# EAGLE design placa_final (EAGLE 8.0.1)
COMPANY: Unexpected Maker; DATE: 24-10-2018; DRAWN: Seon; REV: V1; TITLE: TinyPICO

## Sheet 1 of 2
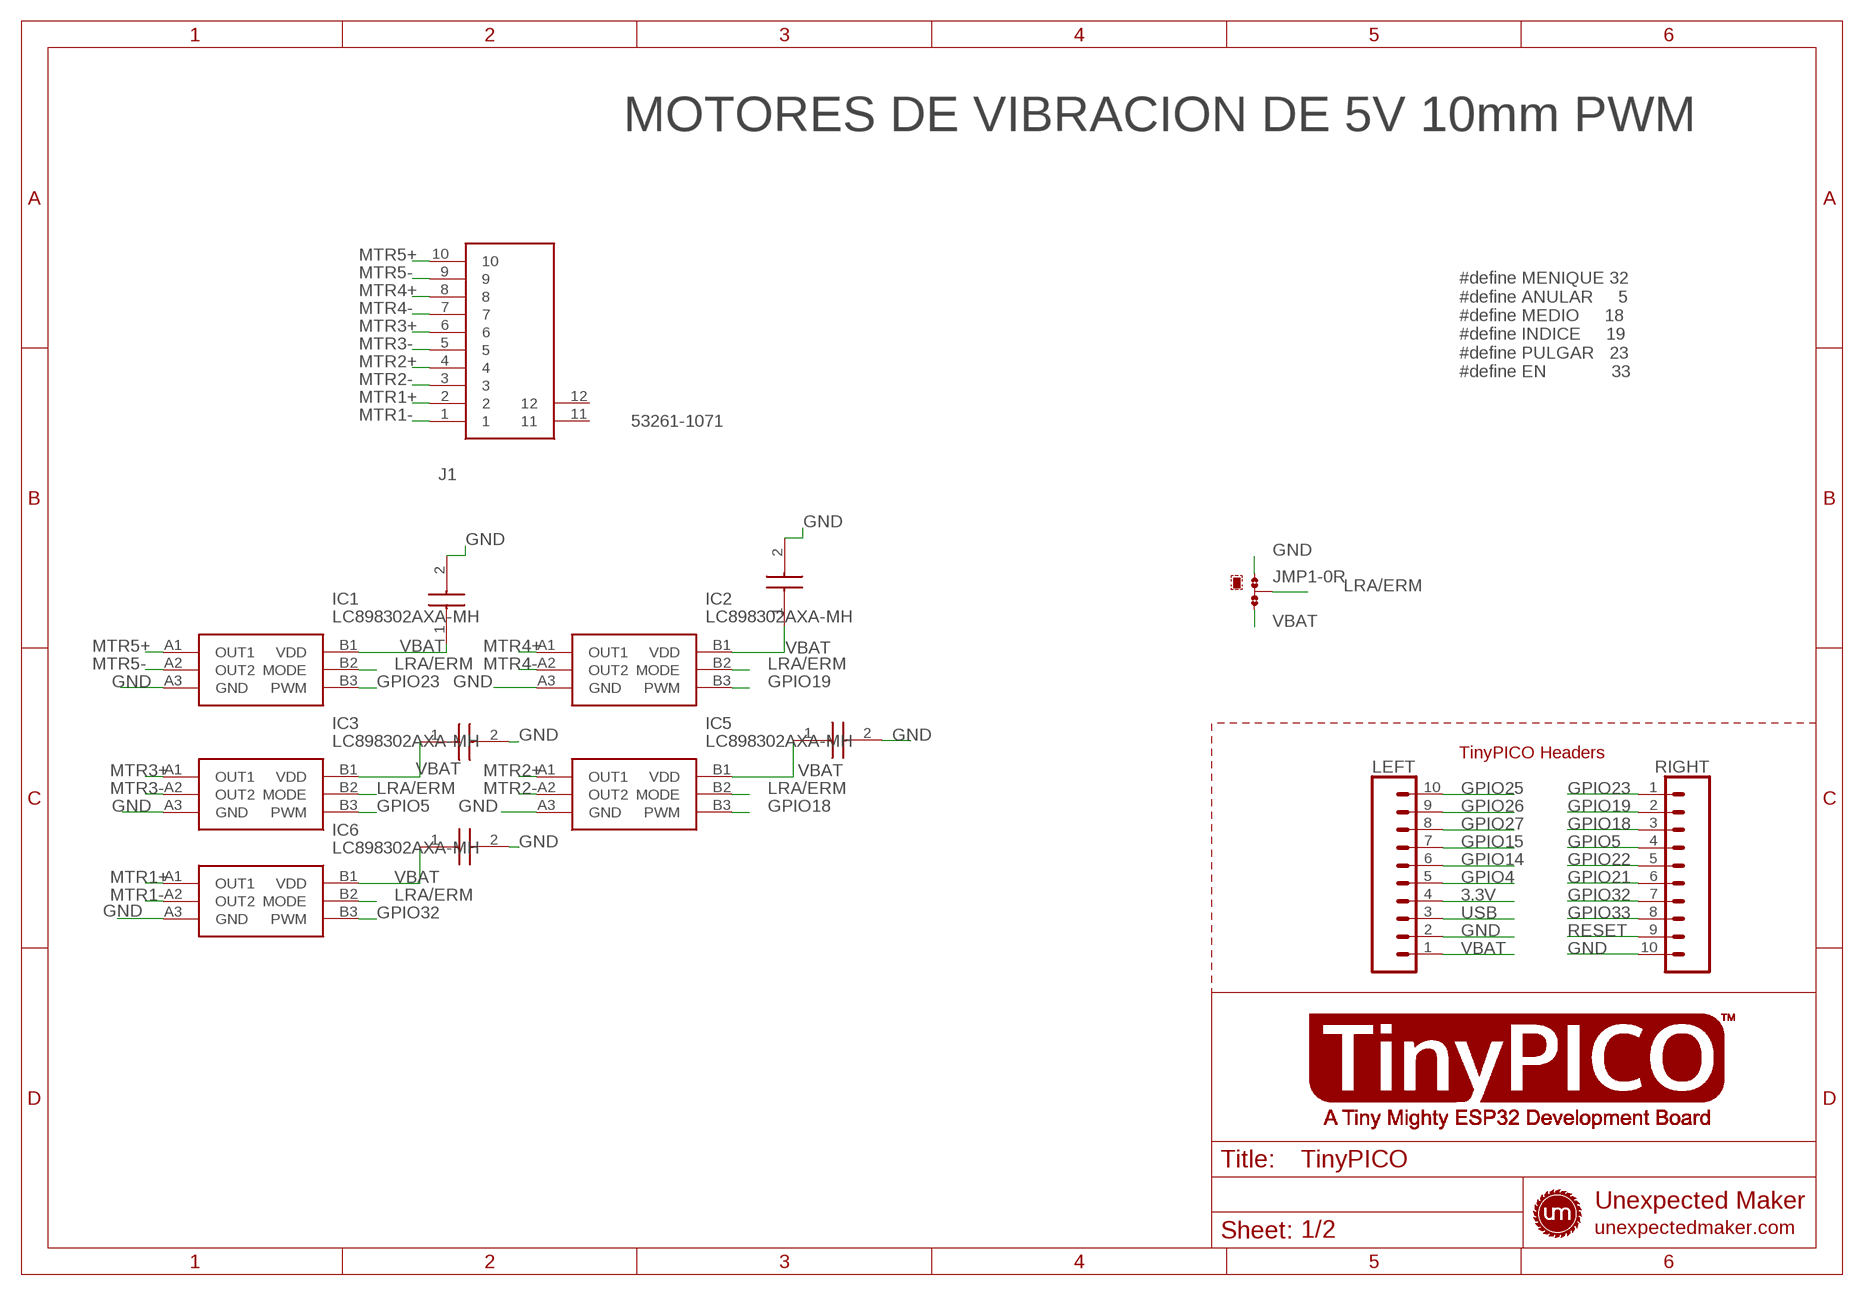
[diagram p0: schematic, sheet 1]

### Parts
C1  0603B104K160CT  [CAPC1608X87N]
C2  0603B104K160CT  [CAPC1608X87N]
C3  0603B104K160CT  [CAPC1608X87N]
C4  0603B104K160CT  [CAPC1608X87N]
C5  0603B104K160CT  [CAPC1608X87N]
IC1  LC898302AXA-MH  [BGA6C40P3X2_118X78X65]
IC2  LC898302AXA-MH  [BGA6C40P3X2_118X78X65]
IC3  LC898302AXA-MH  [BGA6C40P3X2_118X78X65]
IC5  LC898302AXA-MH  [BGA6C40P3X2_118X78X65]
IC6  LC898302AXA-MH  [BGA6C40P3X2_118X78X65]
J1  53261-1071  [532611071]
JMP1  0R-JUMPA  [A0R-JMP]
LEFT  TINYPICO_HEADER_10NO_SILK_PTH_FEMALE  [1X10_NO_SILK]
RIGHT  TINYPICO_HEADER_10NO_SILK_PTH_FEMALE  [1X10_NO_SILK]

### Nets
3.3V: LEFT.4 ; also sheet 2
GND: C1.2 C2.2 C3.2 C4.2 C5.2 IC1.A3(GND) IC2.A3(GND) IC3.A3(GND) IC5.A3(GND) IC6.A3(GND) JMP1.1 LEFT.2 RIGHT.10 ; also sheet 2
GPIO4: LEFT.5 ; also sheet 2
GPIO5: IC3.B3(PWM) RIGHT.4
GPIO14: LEFT.6 ; also sheet 2
GPIO15: LEFT.7 ; also sheet 2
GPIO18: IC5.B3(PWM) RIGHT.3
GPIO19: IC2.B3(PWM) RIGHT.2
GPIO21: RIGHT.6
GPIO22: RIGHT.5
GPIO23: IC1.B3(PWM) RIGHT.1
GPIO25: LEFT.10
GPIO26: LEFT.9
GPIO27: LEFT.8 ; also sheet 2
GPIO32: IC6.B3(PWM) RIGHT.7
GPIO33: RIGHT.8
LRA/ERM: IC1.B2(MODE) IC2.B2(MODE) IC3.B2(MODE) IC5.B2(MODE) IC6.B2(MODE) JMP1.2
MTR1+: IC6.A1(OUT1) J1.2
MTR1-: IC6.A2(OUT2) J1.1
MTR2+: IC5.A1(OUT1) J1.4
MTR2-: IC5.A2(OUT2) J1.3
MTR3+: IC3.A1(OUT1) J1.6
MTR3-: IC3.A2(OUT2) J1.5
MTR4+: IC2.A1(OUT1) J1.8
MTR4-: IC2.A2(OUT2) J1.7
MTR5+: IC1.A1(OUT1) J1.10
MTR5-: IC1.A2(OUT2) J1.9
RESET: RIGHT.9 ; also sheet 2
USB: LEFT.3
VBAT: C1.1 C2.1 C3.1 C4.1 C5.1 IC1.B1(VDD) IC2.B1(VDD) IC3.B1(VDD) IC5.B1(VDD) IC6.B1(VDD) JMP1.3 LEFT.1
Unconnected: J1.11 J1.12

### Notes on the sheet
- MOTORES DE VIBRACION DE 5V 10mm PWM
- #define MENIQUE 32
  #define ANULAR     5
  #define MEDIO     18
  #define INDICE     19
  #define PULGAR   23
  #define EN             33
- TinyPICO Headers

## Sheet 2 of 2: Botons
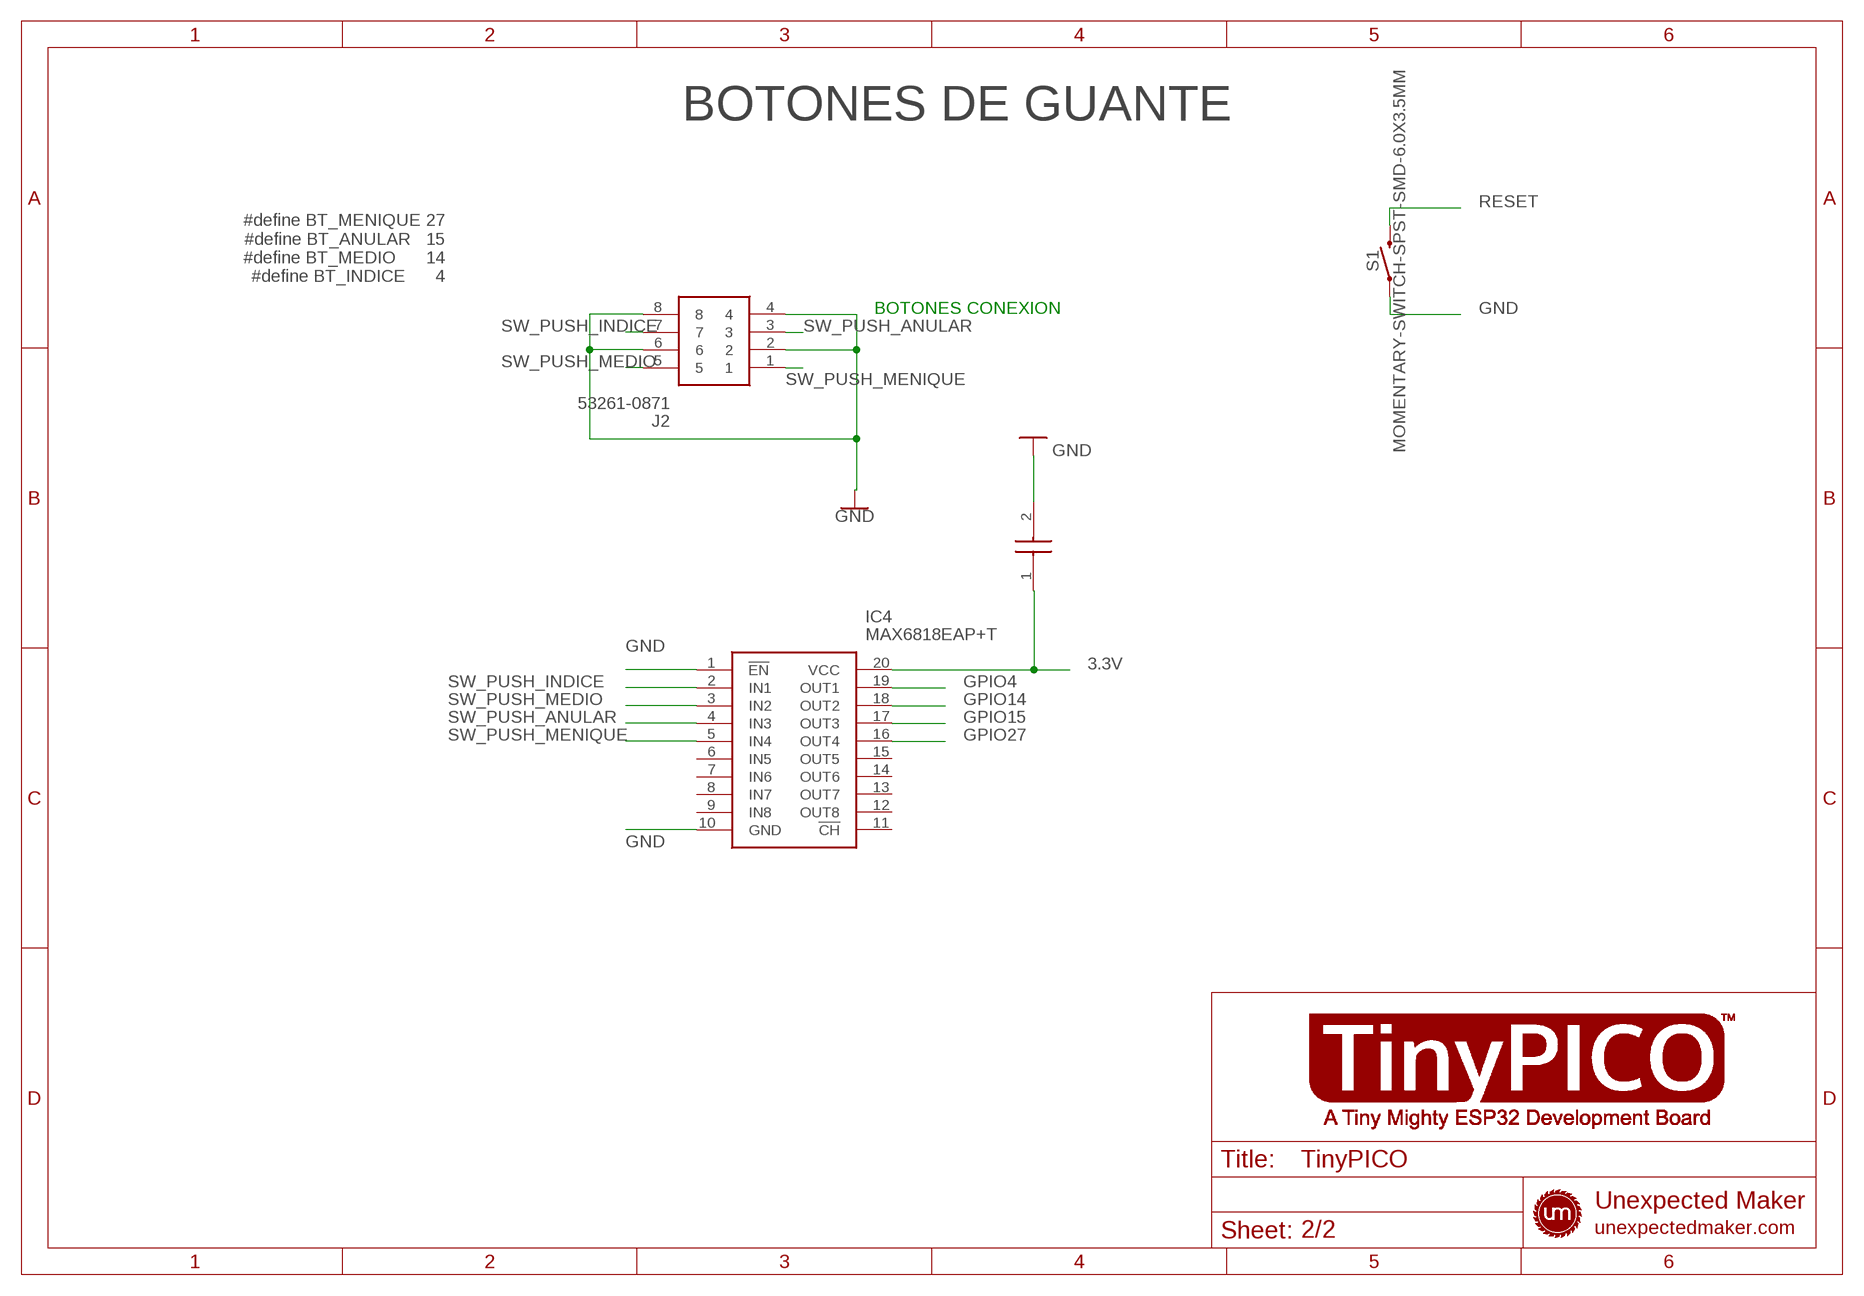
[diagram p1: schematic, sheet 2]

### Parts
C8  0603B104K160CT  [CAPC1608X87N]
IC4  MAX6818EAP+T  [SOP65P778X199-20N]
J2  53261-0871  [53261-0871]
S1  MOMENTARY-SWITCH-SPST-SMD-6.0X3.5MM  [TACTILE_SWITCH_SMD_6.0X3.5MM]

### Nets
3.3V: C8.1 IC4.20(VCC) ; also sheet 1
GND: C8.2 IC4.1(!EN) IC4.10(GND) J2.2 J2.4 J2.6 J2.8 S1.1 ; also sheet 1
GPIO4: IC4.19(OUT1) ; also sheet 1
GPIO14: IC4.18(OUT2) ; also sheet 1
GPIO15: IC4.17(OUT3) ; also sheet 1
GPIO27: IC4.16(OUT4) ; also sheet 1
RESET: S1.2 ; also sheet 1
SW_PUSH_ANULAR: IC4.4(IN3) J2.3
SW_PUSH_INDICE: IC4.2(IN1) J2.7
SW_PUSH_MEDIO: IC4.3(IN2) J2.5
SW_PUSH_MENIQUE: IC4.5(IN4) J2.1
Unconnected: IC4.6(IN5) IC4.7(IN6) IC4.8(IN7) IC4.9(IN8) IC4.11(!CH) IC4.12(OUT8) IC4.13(OUT7) IC4.14(OUT6) IC4.15(OUT5)

### Notes on the sheet
- BOTONES DE GUANTE
- #define BT_MENIQUE 27
  #define BT_ANULAR   15
  #define BT_MEDIO      14
  #define BT_INDICE      4
- BOTONES CONEXION

## Library data of the parts
C1-C5 C8 = SamacSys_Parts:0603B104K160CT: WALSIN - 0603B104K160CT - CAP, 0.1F, 16V, 10%, X7R, 0603 Source: Datasheet <https://componentsearchengine.com/Datasheets/1/0603B104K160CT.pdf>; DESCRIPTION: WALSIN - 0603B104K160CT - CAP, 0.1F, 16V, 10%, X7R, 0603; HEIGHT: 0.87mm; MANUFACTURER_NAME: Walsin Technology Corporation; MANUFACTURER_PART_NUMBER: 0603B104K160CT; MOUSER_PART_NUMBER: 791-0603B104K160CT; MOUSER_PRICE-STOCK: https://www.mouser.com/Search/Refine.aspx?Keyword=791-0603B104K160CT
IC1-IC3 IC5 IC6 = SamacSys_Parts:LC898302AXA-MH: Motor / Motion / Ignition Controllers & Drivers Linear Vibrator Driv Source: Datasheet <https://www.arrow.com/en/products/lc898302axa-mh/on-semiconductor>; DESCRIPTION: Motor / Motion / Ignition Controllers & Drivers Linear Vibrator Driv; HEIGHT: 0.65mm; MANUFACTURER_NAME: ON Semiconductor; MANUFACTURER_PART_NUMBER: LC898302AXA-MH; MOUSER_PART_NUMBER: 863-LC898302AXA-MH; MOUSER_PRICE-STOCK: https://www.mouser.co.uk/ProductDetail/ON-Semiconductor/LC898302AXA-MH?qs=raqtESnDWsCbGq19hBfPlw%3D%3D
IC4 = SamacSys_Parts:MAX6818EAP+T: MAXIM INTEGRATED PRODUCTS - MAX6818EAP+T. - ESD PROTE WITH SWITCH DEBOUNCER, SSOP-20 Source: Datasheet; DESCRIPTION: MAXIM INTEGRATED PRODUCTS - MAX6818EAP+T. - ESD PROTE WITH SWITCH DEBOUNCER, SSOP-20; HEIGHT: 1.99mm; MANUFACTURER_NAME: Maxim Integrated; MANUFACTURER_PART_NUMBER: MAX6818EAP+T; MOUSER_PART_NUMBER: 700-MAX6818EAPT; MOUSER_PRICE-STOCK: https://www.mouser.co.uk/ProductDetail/Maxim-Integrated/MAX6818EAP%2bT?qs=CDqwynd4ZNoKt6d34O8j%252BA%3D%3D
J1 = SamacSys_Parts:53261-1071: 10 way SMT r/a header Molex PICOBLADE Series, Series Number 53261, 1.25mm Pitch 10 Way 1 Row Shrouded Right Angle PCB Header, Surface Mount Source: Datasheet <https://www.molex.com/webdocs/datasheets/pdf/en-us/0532611071_PCB_HEADERS.pdf>; DESCRIPTION: 10 way SMT r/a header Molex PICOBLADE Series, Series Number 53261, 1.25mm Pitch 10 Way 1 Row Shrouded Right Angle PCB Header, Surface Mount; HEIGHT: 3mm; MANUFACTURER_NAME: Molex; MANUFACTURER_PART_NUMBER: 53261-1071; MOUSER_PART_NUMBER: 538-53261-1071; MOUSER_PRICE-STOCK: https://www.mouser.co.uk/ProductDetail/Molex/53261-1071?qs=%252B72YyncTwW%252Bzs3RwZTiukQ%3D%3D
J2 = SamacSys_Parts:53261-0871: Molex PICOBLADE Series, Series Number 53261, 1.25mm Pitch, 8 Way 1 Row Shrouded Right Angle PCB Header, Surface Mount Source: Datasheet <http://www.molex.com/webdocs/datasheets/pdf/en-us/0532610871_PCB_HEADERS.pdf>; DESCRIPTION: Molex PICOBLADE Series, Series Number 53261, 1.25mm Pitch, 8 Way 1 Row Shrouded Right Angle PCB Header, Surface Mount; HEIGHT: mm; MANUFACTURER_NAME: Molex; MANUFACTURER_PART_NUMBER: 53261-0871; MOUSER_PART_NUMBER: 538-53261-0871; MOUSER_PRICE-STOCK: https://www.mouser.co.uk/ProductDetail/Molex/53261-0871?qs=%252B72YyncTwW%252BggfdCJ7Netw%3D%3D
JMP1 = jump-0r-smd:0R-JUMP: SMD 0R 0805 Jumper
LEFT RIGHT = UnexpectedMaker:TINYPICO_HEADER_10: Multi connection point. Often used as Generic Header-pin footprint for 0.1 inch spaced/style header connections On any of the 0.1 inch spaced packages, you can populate with these: Break Away Headers - Straight <https://www.sparkfun.com/products/116> (PRT-00116) Break Away Male Headers - Right Angle <https://www.sparkfun.com/products/553> (PRT-00553) Female Headers <https://www.sparkfun.com/products/115> (PRT-00115) Break Away Headers - Machine Pin <https://www.sparkfun.com/products/117> (PRT-00117) Break Away Female Headers - Swiss Machine Pin <https://www.sparkfun.com/products/743> (PRT-00743) Arduino Stackable Header - 10 Pin <https://www.sparkfun.com/products/11376> (PRT-11376) For SCREWTERMINALS and SPRING TERMINALS visit here: Screw Terimnals on SparkFun.com <https://www.sparkfun.com/search/results?term=Screw+Terminals> (5mm/3.5mm/2.54mm spacing) This device is also useful as a general connection point to wire up your design to another part of your project. Our various solder wires solder well into these plated through hole pads. Hook-Up Wire - Assortment (Stranded, 22 AWG) <https://www.sparkfun.com/products/11375> (PRT-11375) Hook-Up Wire - Assortment (Solid Core, 22 AWG) <https://www.sparkfun.com/products/11367> (PRT-11367) View the entire wire category on our website here <https://www.sparkfun.com/categories/141> Special notes: Molex polarized connector foot print use with SKU : PRT-08231 with associated crimp pins and housings. 1MM SMD Version SKU: PRT-10208 NOTES ON THE VARIANTS LOCK and LOCK_LONGPADS... This footprint was designed to help hold the alignment of a through-hole component (i.e. 6-pin header) while soldering it into place. You may notice that each hole has been shifted either up or down by 0.005 of an inch from it's more standard position (which is a perfectly straight line). This slight alteration caused the pins (the squares in the middle) to touch the edges of the holes. Because they are alternating, it causes a "brace" to hold the component in place. 0.005 has proven to be the perfect amount of "off-center" position when using our standard breakaway headers. Although looks a little odd when you look at the bare footprint, once you have a header in there, the alteration is very hard to notice. Also,if you push a header all the way into place, it is covered up entirely on the bottom side.; PROD_ID: CONN-11563
S1 = SparkFun-Switches:MOMENTARY-SWITCH-SPST: Momentary Switch (Pushbutton) - SPST Normally-open (NO) SPST momentary switches (buttons, pushbuttons). Variants PTH-12MM - 12mm square, through-hole Momentary Pushbutton Switch - 12mm Square <https://www.sparkfun.com/products/9190> (COM-09190) PTH-6.0MM, PTH-6.0MM-KIT - 6.0mm square, through-hole Mini Pushbutton Switch <https://www.sparkfun.com/products/97> (COM-00097) KIT package intended for soldering kit's - only one side of pads' copper is exposed. PTH-RIGHT-ANGLE-KIT - Right-angle, through-hole Right Angle Tactile Button <https://www.sparkfun.com/products/10791> - Used on SparkFun BigTime Watch Kit <https://www.sparkfun.com/products/11734> SMD-12MM - 12mm square, surface-mount Tactile Button - SMD (12mm) <https://www.sparkfun.com/products/12993> (COM-12993) Used on SparkFun PicoBoard <https://www.sparkfun.com/products/11888> SMD-4.5MM - 4.5mm Square Trackball Switch Used on SparkFun Blackberry Trackballer Breakout <https://www.sparkfun.com/products/13169> SMD-4.6MMX2.8MM - 4.60mm x 2.80mm, surface mount Used on SparkFun SAMD21 Mini Breakout <https://www.sparkfun.com/products/13664> SMD-5.2MM, SMD-5.2-REDUNDANT - 5.2mm square, surface-mount Mini Pushbutton Switch - SMD <https://www.sparkfun.com/products/8720> (COM-08720) Used on Arduino Pro Mini <https://www.sparkfun.com/products/11114> REDUNDANT package connects both switch circuits together SMD-6.0X3.5MM - 6.0 x 3.5mm, surface mount Momentary Reset Switch SMD <https://www.sparkfun.com/products/8229> (COM-08229) SMD-6.2MM-TALL - 6.2mm square, surface mount Tactile Button - SMD (6mm) <https://www.sparkfun.com/products/12992> Used on SparkFun Digital Sandbox <https://www.sparkfun.com/products/12651> SMD-RIGHT-ANGLE - Right-angle, surface mount Used on SparkFun Block for Intel® Edison - Arduino <https://www.sparkfun.com/products/13036>; PROD_ID: SWCH-00815; SF_SKU: COM-08229

## Board
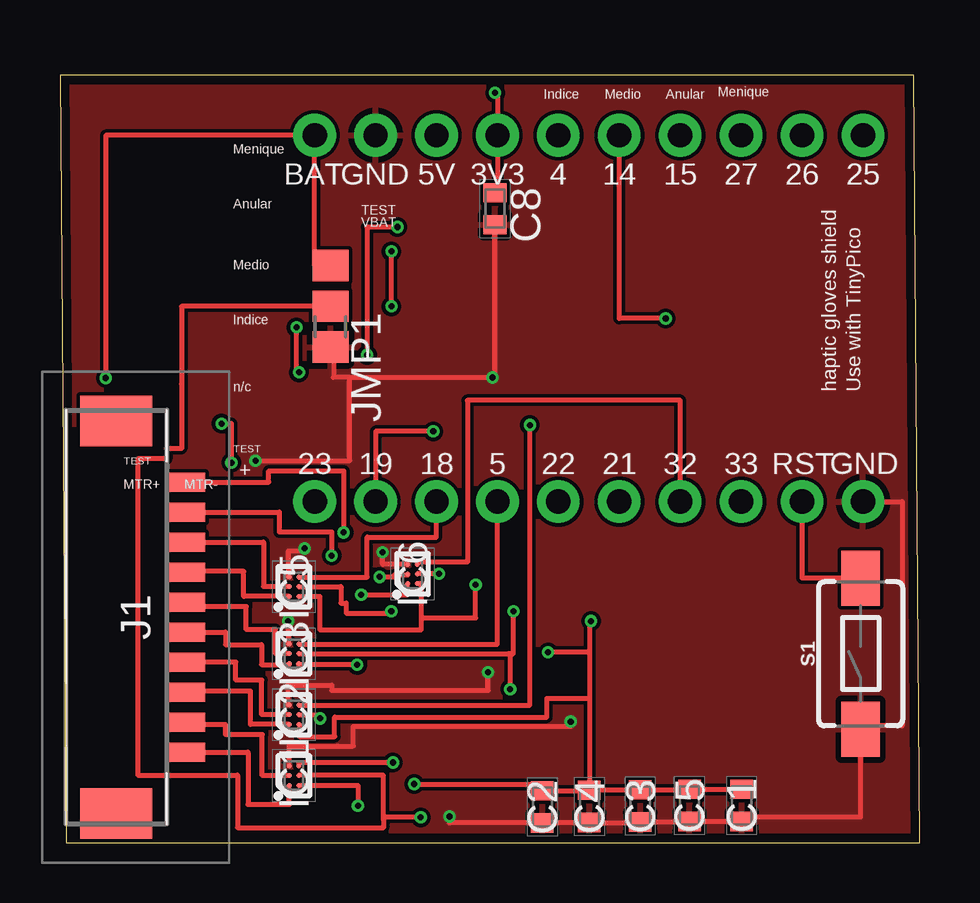
[diagram p2: board, top side]
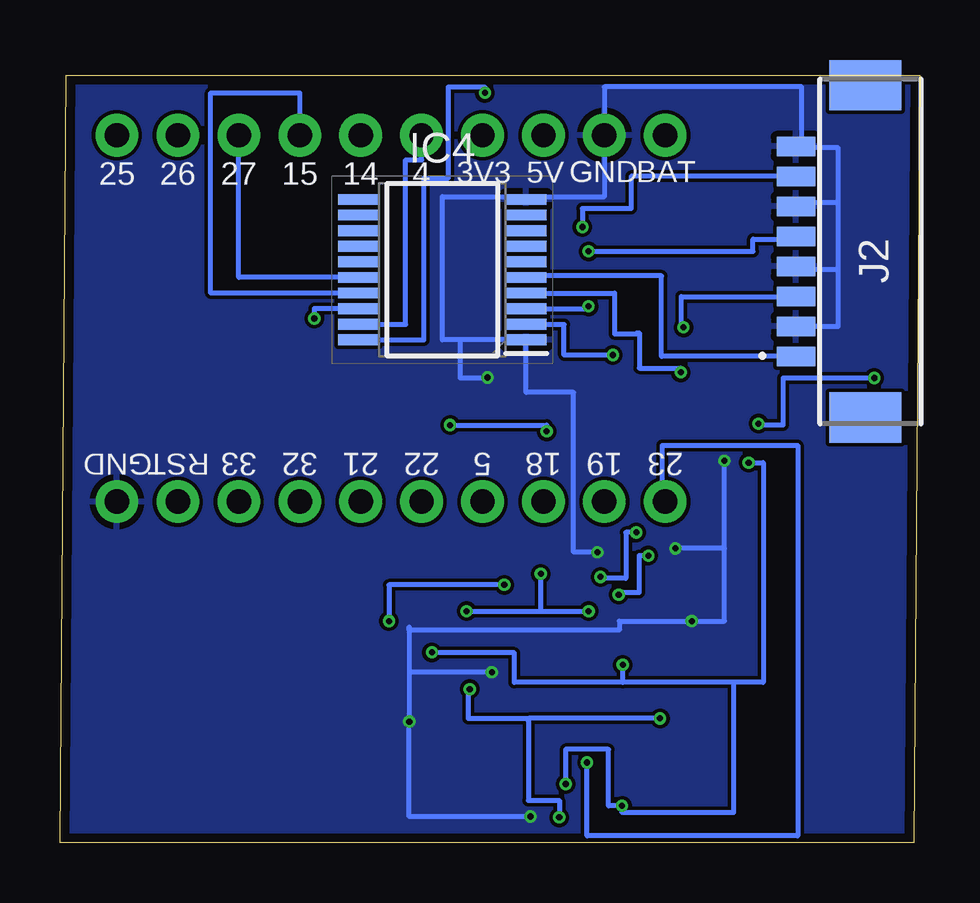
[diagram p3: board, bottom side, seen from below]

Size 35.85 x 31.97 mm. Coordinates in mm from the lower left corner, seen from the top.
Outline: 0,31.97 0.25,0 35.85,0 35.6,31.97 0,31.97
Copper layers (1*16): Top 0.035559375mm / dielectric 1.6mm / Bottom 0.035559375mm
Design rules "oshpark-2layer": minimum track width 6mil, minimum drill 10mil, track to track 6mil, track to pad 6mil, pad to pad 6mil, via to via 6mil, smd to smd 6mil, copper to edge 15mil, drill to drill 6mil, minimum pad ring 5mil, minimum via ring 5mil, stop-mask expansion 2.5mil, vias tented up to drill 0mil, thermal gap 10mil

### Footprints (pad centres in the part's own frame; a part is rotated, then mirrored left to right if it is on the bottom)
CAPC1608X87N = smd 0.8 x 0.94: 1 -0.67,0; 2 0.67,0
BGA6C40P3X2_118X78X65 = smd 0.2 x 0.2: A1 -0.4,0.2; A2 0,0.2; A3 0.4,0.2; B1 -0.4,-0.2; B2 0,-0.2; B3 0.4,-0.2
SOP65P778X199-20N = smd 1.705 x 0.45: 1 -3.498,2.925; 2 -3.498,2.275; 3 -3.498,1.625; 4 -3.498,0.975; 5 -3.498,0.325; 6 -3.498,-0.325; 7 -3.498,-0.975; 8 -3.498,-1.625; 9 -3.498,-2.275; 10 -3.498,-2.925; 11 3.498,-2.925; 12 3.498,-2.275; 13 3.498,-1.625; 14 3.498,-0.975; 15 3.498,-0.325; 16 3.498,0.325; 17 3.498,0.975; 18 3.498,1.625; 19 3.498,2.275; 20 3.498,2.925
532611071 = smd 0.8 x 1.6: 1 -5.625,2.1; 2 -4.375,2.1; 3 -3.125,2.1; 4 -1.875,2.1; 5 -0.625,2.1; 6 0.625,2.1; 7 1.875,2.1; 8 3.125,2.1; 9 4.375,2.1; 10 5.625,2.1 | smd 2.1 x 3: 11 -8.175,-0.8; 12 8.175,-0.8
53261-0871 = smd 0.8 x 1.6: 1 -4.375,1.004; 2 -3.125,1.004; 3 -1.875,1.004; 4 -0.625,1.004; 5 0.625,1.004; 6 1.875,1.004; 7 3.125,1.004; 8 4.375,1.004 | smd 2.1 x 3: 9 6.925,-1.896; 10 -6.925,-1.896
A0R-JMP = smd 1.5 x 1.3: 1 0,1.7; 2 0,0; 3 0,-1.7
1X10_NO_SILK = drill 1.016 pad 1.778: 1 0,0; 2 2.54,0; 3 5.08,0; 4 7.62,0; 5 10.16,0; 6 12.7,0; 7 15.24,0; 8 17.78,0; 9 20.32,0; 10 22.86,0
TACTILE_SWITCH_SMD_6.0X3.5MM = smd 2.3 x 1.6: 1 -3.15,0; 2 3.15,0

### Placement (x,y rotation side)
C1  28.42,1.55 270 top
C2  20.11,1.49 270 top
C3  24.19,1.53 270 top
C4  22.07,1.51 270 top
C5  26.24,1.55 270 top
C8  18.14,26.41 270 top
IC1  9.75,2.79 90 top
IC2  9.75,5.33 90 top
IC3  9.75,7.87 90 top
IC4  19.91,23.87 180 bottom
IC5  9.75,10.67 90 top
IC6  14.69,11.19 90 top
J1  3.15,9.4 270 top
J2  4.17,24.64 90 bottom
JMP1  11.28,22.35 180 top
LEFT  10.62,29.47 0 top
RIGHT  10.62,14.21 0 top
S1  33.38,7.87 90 top

### Tracks (layer width: path | path; a pad name or v marks a point on that pad's centre or on a via)
3.3V  (via drill 0.25 pad 0.25)
  Top 0.203: C8.1 18.24,27.08 LEFT.4 18.24,31.24 v18.14,31.24
  Bottom 0.203: IC4.20 20.68,20.95 20.68,27.68 19.66,27.68 19.66,31.49 18.14,31.49 v18.14,31.24
GND  (via drill 0.25 pad 0.25)
  Top 0.203: IC6.A3 13.45,11.59 v13.45,12.1 | JMP1.1 11.4,20.65 11.4,19.38 12.07,19.38 | 12.07,19.38 v18.04,19.38 18.14,19.38 C8.2 | 22.07,0.86 C4.2 | 26.24,0.86 C5.2 | RIGHT.10 35.11,14.21 35.11,4.87 33.38,4.87 S1.1 33.37,1.07 28.42,1.07 C1.2 C5.2 | IC1.A3 9.55,4.03 11.56,4.03 | 11.56,4.03 11.56,4.01 | IC2.A3 9.51,5.73 9.51,6.56 11.33,6.56 11.33,6.34 17.85,6.34 v17.85,7.1 | IC3.A3 9.52,8.27 v9.52,9.23 | v9.52,9.23 9.52,9.36 v9.52,9.23 | IC5.A3 9.52,11.07 9.52,12.16 10.19,12.16 v10.19,12.26 | C4.2 22.07,0.82 C2.2 16.24,0.82 v16.24,1.09 | C4.2 24.19,0.84 C3.2 26.24,0.86 | 26.24,0.86 C5.2 | 11.56,4.03 12.22,4.03 12.22,4.85 21.29,4.85 v21.29,5.05 | v8.15,15.91 12.07,15.91 12.07,19.38
  Bottom 0.203: J2.2 3.4,21.51 3.4,23.87 | 3.4,23.87 5.17,23.87 J2.4 | 3.4,23.87 3.4,26.67 | 3.4,26.67 5.17,26.67 J2.6 | 3.4,26.67 3.4,28.95 5.17,28.95 J2.8 4.93,29.01 4.93,31.49 13.16,31.49 LEFT.2 13.16,26.92 16.42,26.92 | 19.17,20.95 IC4.1 16.42,18.76 14.44,18.76 14.44,12.1 v13.45,12.1 | 19.17,20.95 19.91,20.95 19.91,26.92 16.42,26.92 | 16.42,26.92 IC4.10 | 19.17,20.95 19.17,19.36 18.04,19.36 v18.04,19.38 | v16.24,1.09 21.29,1.09 v21.29,5.05 21.29,6.71 | 21.29,6.71 21.29,8.99 21.29,8.86 12.54,8.86 12.54,9.23 v9.52,9.23 8.15,9.23 8.15,12.26 | v17.85,7.1 21.29,7.1 21.29,6.71 | 8.15,12.26 v10.19,12.26 | 8.15,12.26 v8.15,15.91
  pour Bottom: 35.63,33.37 35.63,-3.68 -1.02,-3.68 -1.02,33.37
  pour Top: -1.17,33.53 -1.17,-4.57 35.66,-4.57 35.66,33.53
GPIO4
  Bottom 0.203: IC4.19 21.44,21.6 21.44,28.45 20.78,28.45 LEFT.5
GPIO5
  Top 0.203: IC3.B3 18.24,8.27 RIGHT.4
GPIO14  (via drill 0.25 pad 0.25)
  Top 0.203: v25.25,21.84 23.32,21.84 LEFT.6
  Bottom 0.203: IC4.18 25.25,22.25 v25.25,21.84
GPIO15
  Bottom 0.203: IC4.17 29.57,22.9 29.57,31.24 25.86,31.24 LEFT.7
GPIO18
  Top 0.203: IC5.B3 12.81,11.07 12.81,12.73 15.7,12.73 RIGHT.3
GPIO19  (via drill 0.25 pad 0.25)
  Top 0.203: IC2.B3 19.59,5.73 v19.59,17.4 | v15.56,17.14 13.16,17.14 RIGHT.2
  Bottom 0.203: v19.59,17.4 15.56,17.4 v15.56,17.14
GPIO23  (via drill 0.25 pad 0.25)
  Top 0.203: v13.88,3.34 9.95,3.34 IC1.B3
  Bottom 0.203: RIGHT.1 10.74,14.21 10.74,16.55 5.1,16.55 5.1,0.28 13.88,0.28 v13.88,3.34
GPIO27
  Bottom 0.203: IC4.16 28.4,23.55 LEFT.8
GPIO32
  Top 0.203: RIGHT.7 25.86,18.43 16.99,18.43 16.99,11.69 14.89,11.69 IC6.B3
LRA/ERM  (via drill 0.25 pad 0.25)
  Top 0.203: JMP1.2 5.07,22.35 5.07,19.1 5.07,16.41 4.44,16.41 4.44,15.99 3.24,15.99 3.24,2.81 7.4,2.81 7.4,0.62 13.48,0.62 13.48,0.96 | IC5.B2 11.71,10.67 11.71,9.98 11.93,9.98 11.93,9.57 13.81,9.57 v13.81,9.65 | v15.81,11.2 IC6.B2 | 13.48,0.96 13.48,2.8 IC1.B2 | IC3.B2 18.71,7.87 | 18.71,7.87 18.9,7.87 v18.9,9.65 | IC2.B2 10.84,5.33 v10.84,5.18 | v15.04,1.05 13.48,1.05 13.48,0.96 | 18.71,7.87 18.77,7.87 v18.77,6.39
  Bottom 0.203: 15.81,9.65 v13.81,9.65 | 15.81,9.65 v15.81,11.2 | v18.9,9.65 15.81,9.65 | v10.84,5.18 16.32,5.18 16.32,5.07 | 16.32,5.07 16.32,1.76 15.04,1.76 v15.04,1.05 | v18.77,6.39 18.84,6.39 18.84,5.17 16.32,5.17 16.32,5.07
MTR1+  (via drill 0.25 pad 0.25)
  Top 0.203: J1.2 9.14,13.77 9.14,12.95 11.33,12.95 v11.33,11.96 | v12.56,10.33 14.49,10.33 IC6.A1
  Bottom 0.203: v11.33,11.96 11.71,11.96 11.71,10.42 12.56,10.42 v12.56,10.33
MTR1-  (via drill 0.25 pad 0.25)
  Top 0.203: J1.1 8.71,15.02 8.71,15.49 11.83,15.49 v11.83,12.93 | v13.32,11.07 13.94,11.07 13.94,11.16 14.49,11.16 IC6.A2
  Bottom 0.203: v11.83,12.93 12.27,12.93 12.27,11.01 13.32,11.01 v13.32,11.07
MTR2+
  Top 0.203: IC5.A1 7.66,10.27 7.66,11.31 5.25,11.31 J1.4
MTR2-
  Top 0.203: J1.3 8.48,12.52 8.48,10.68 9.55,10.68 IC5.A2
MTR3+
  Top 0.203: J1.6 6.9,8.77 6.9,8.25 8.4,8.25 8.4,7.42 9.55,7.42 IC3.A1
MTR3-
  Top 0.203: IC3.A2 8.97,7.87 8.97,8.88 7.77,8.88 7.77,9.83 5.25,9.83 J1.5
MTR4+
  Top 0.203: IC2.A1 7.94,4.93 7.94,6.31 5.25,6.31 J1.8
MTR4-
  Top 0.203: 5.25,7.49 J1.7 7.33,7.52 7.33,6.77 8.41,6.77 8.41,5.33 IC2.A2
MTR5+
  Top 0.203: J1.10 7.84,3.77 7.84,1.6 9.55,1.6 IC1.A1
MTR5-
  Top 0.203: 5.25,4.96 J1.9 5.25,4.92 6.9,4.92 6.9,4.5 8.43,4.5 8.43,2.79 IC1.A2
RESET
  Top 0.203: S1.2 30.94,11.02 RIGHT.9
SW_PUSH_ANULAR  (via drill 0.25 pad 0.25)
  Top 0.203: v9.97,19.6 9.86,19.6 v9.86,21.47
  Bottom 0.203: 5.17,22.6 J2.3 9.95,22.76 9.95,21.47 v9.86,21.47 | IC4.4 12.73,22.9 12.73,21.2 11.81,21.2 11.81,21.24 11.7,21.24 11.7,19.78 9.97,19.78 v9.97,19.6
SW_PUSH_INDICE  (via drill 0.25 pad 0.25)
  Top 0.203: v14.07,25.65 12.8,25.65 v12.8,20.32
  Bottom 0.203: J2.7 12.04,27.76 12.04,26.41 14.07,26.41 v14.07,25.65 | v12.8,20.32 14.83,20.32 14.83,21.59 16.42,21.59 IC4.2
SW_PUSH_MEDIO  (via drill 0.25 pad 0.25)
  Top 0.203: v13.82,22.35 v13.82,24.64
  Bottom 0.203: IC4.3 13.82,22.25 v13.82,22.35 | v13.82,24.64 6.96,24.64 6.96,25.14 5.17,25.14 J2.5
SW_PUSH_MENIQUE
  Bottom 0.203: J2.1 10.77,20.26 10.77,23.62 16.42,23.62 IC4.5
VBAT  (via drill 0.25 pad 0.25)
  Top 0.203: JMP1.3 10.62,24.05 LEFT.1 1.91,29.48 v1.91,19.36 | IC6.B1 15.07,10.79 15.07,9.36 | IC5.B1 10.83,10.27 10.83,8.88 15.07,8.88 15.07,9.36 | v6.73,17.46 7.15,17.46 v7.15,15.83 | v12.39,7.41 9.95,7.41 IC3.B1 | IC1.B1 12.42,2.39 v12.42,1.54 | C4.1 22.07,2.16 C2.1 20.11,2.44 v14.77,2.44 | C4.1 22.07,2.2 C3.1 26.24,2.2 C5.1 C1.1 | 22.07,6.01 20.29,6.01 20.29,5.23 11.46,5.23 11.46,4.42 9.99,4.42 9.99,4.93 IC2.B1 | 22.07,6.01 C4.1 | 22.07,7.93 v20.34,7.93 | 22.07,7.93 22.07,6.01 | 15.07,9.36 17.33,9.36 v17.33,10.74 | v22.14,9.23 22.07,9.23 22.07,7.93
  Bottom 0.203: v1.91,19.36 5.72,19.36 5.72,17.39 6.73,17.39 v6.73,17.46 | v7.15,15.83 6.53,15.83 6.53,6.68 7.77,6.68 | 7.77,6.68 12.39,6.68 | 12.39,6.68 v12.39,7.41 | v14.77,2.44 14.77,3.89 12.98,3.89 12.98,1.54 v12.42,1.54 12.42,1.25 7.77,1.25 7.77,6.68 | 12.39,6.68 16.91,6.68 16.91,7.91 20.34,7.91 v20.34,7.93 | v17.33,10.74 22.14,10.74 v22.14,9.23

### Text on the board
tPlace: Menique | Indice | Medio | Anular | Menique | Anular | TEST | VBAT | Medio | Indice | n/c | haptic gloves shield | Use with TinyPico | TEST | TEST | +
tNames: BAT | GND | 5V | 3V3 | 4 | 14 | 15 | 27 | 26 | 25 | 23 | 19 | 18 | 5 | 22 | 21 | 32 | 33 | RST | GND | MTR+ | MTR-
bNames: BAT | GND | 5V | 3V3 | 4 | 14 | 15 | 27 | 26 | 25 | RST | GND | 23 | 19 | 18 | 5 | 22 | 21 | 32 | 33